# Altium schematic sheet Sheet3.SchDoc: VISB
size 420 x 297 mm; ApprovedBy: PBaizan; CheckedBy: PBaizan; Author: PBaizan; CompanyName: IONOSENS; DrawnBy: PBaizan; Engineer: PBaizan; Organization: IONOSENS; DocumentNumber: 20210001001SCH; Revision: 01; SheetNumber: 03; SheetTotal: 03; SubTitle: VISIR Instrument Supply Board (Connectors); CAGE_CODE: 0001-21; SCH_SCALE: None; DOC_NO_SCH_DWG: 210001001SCH
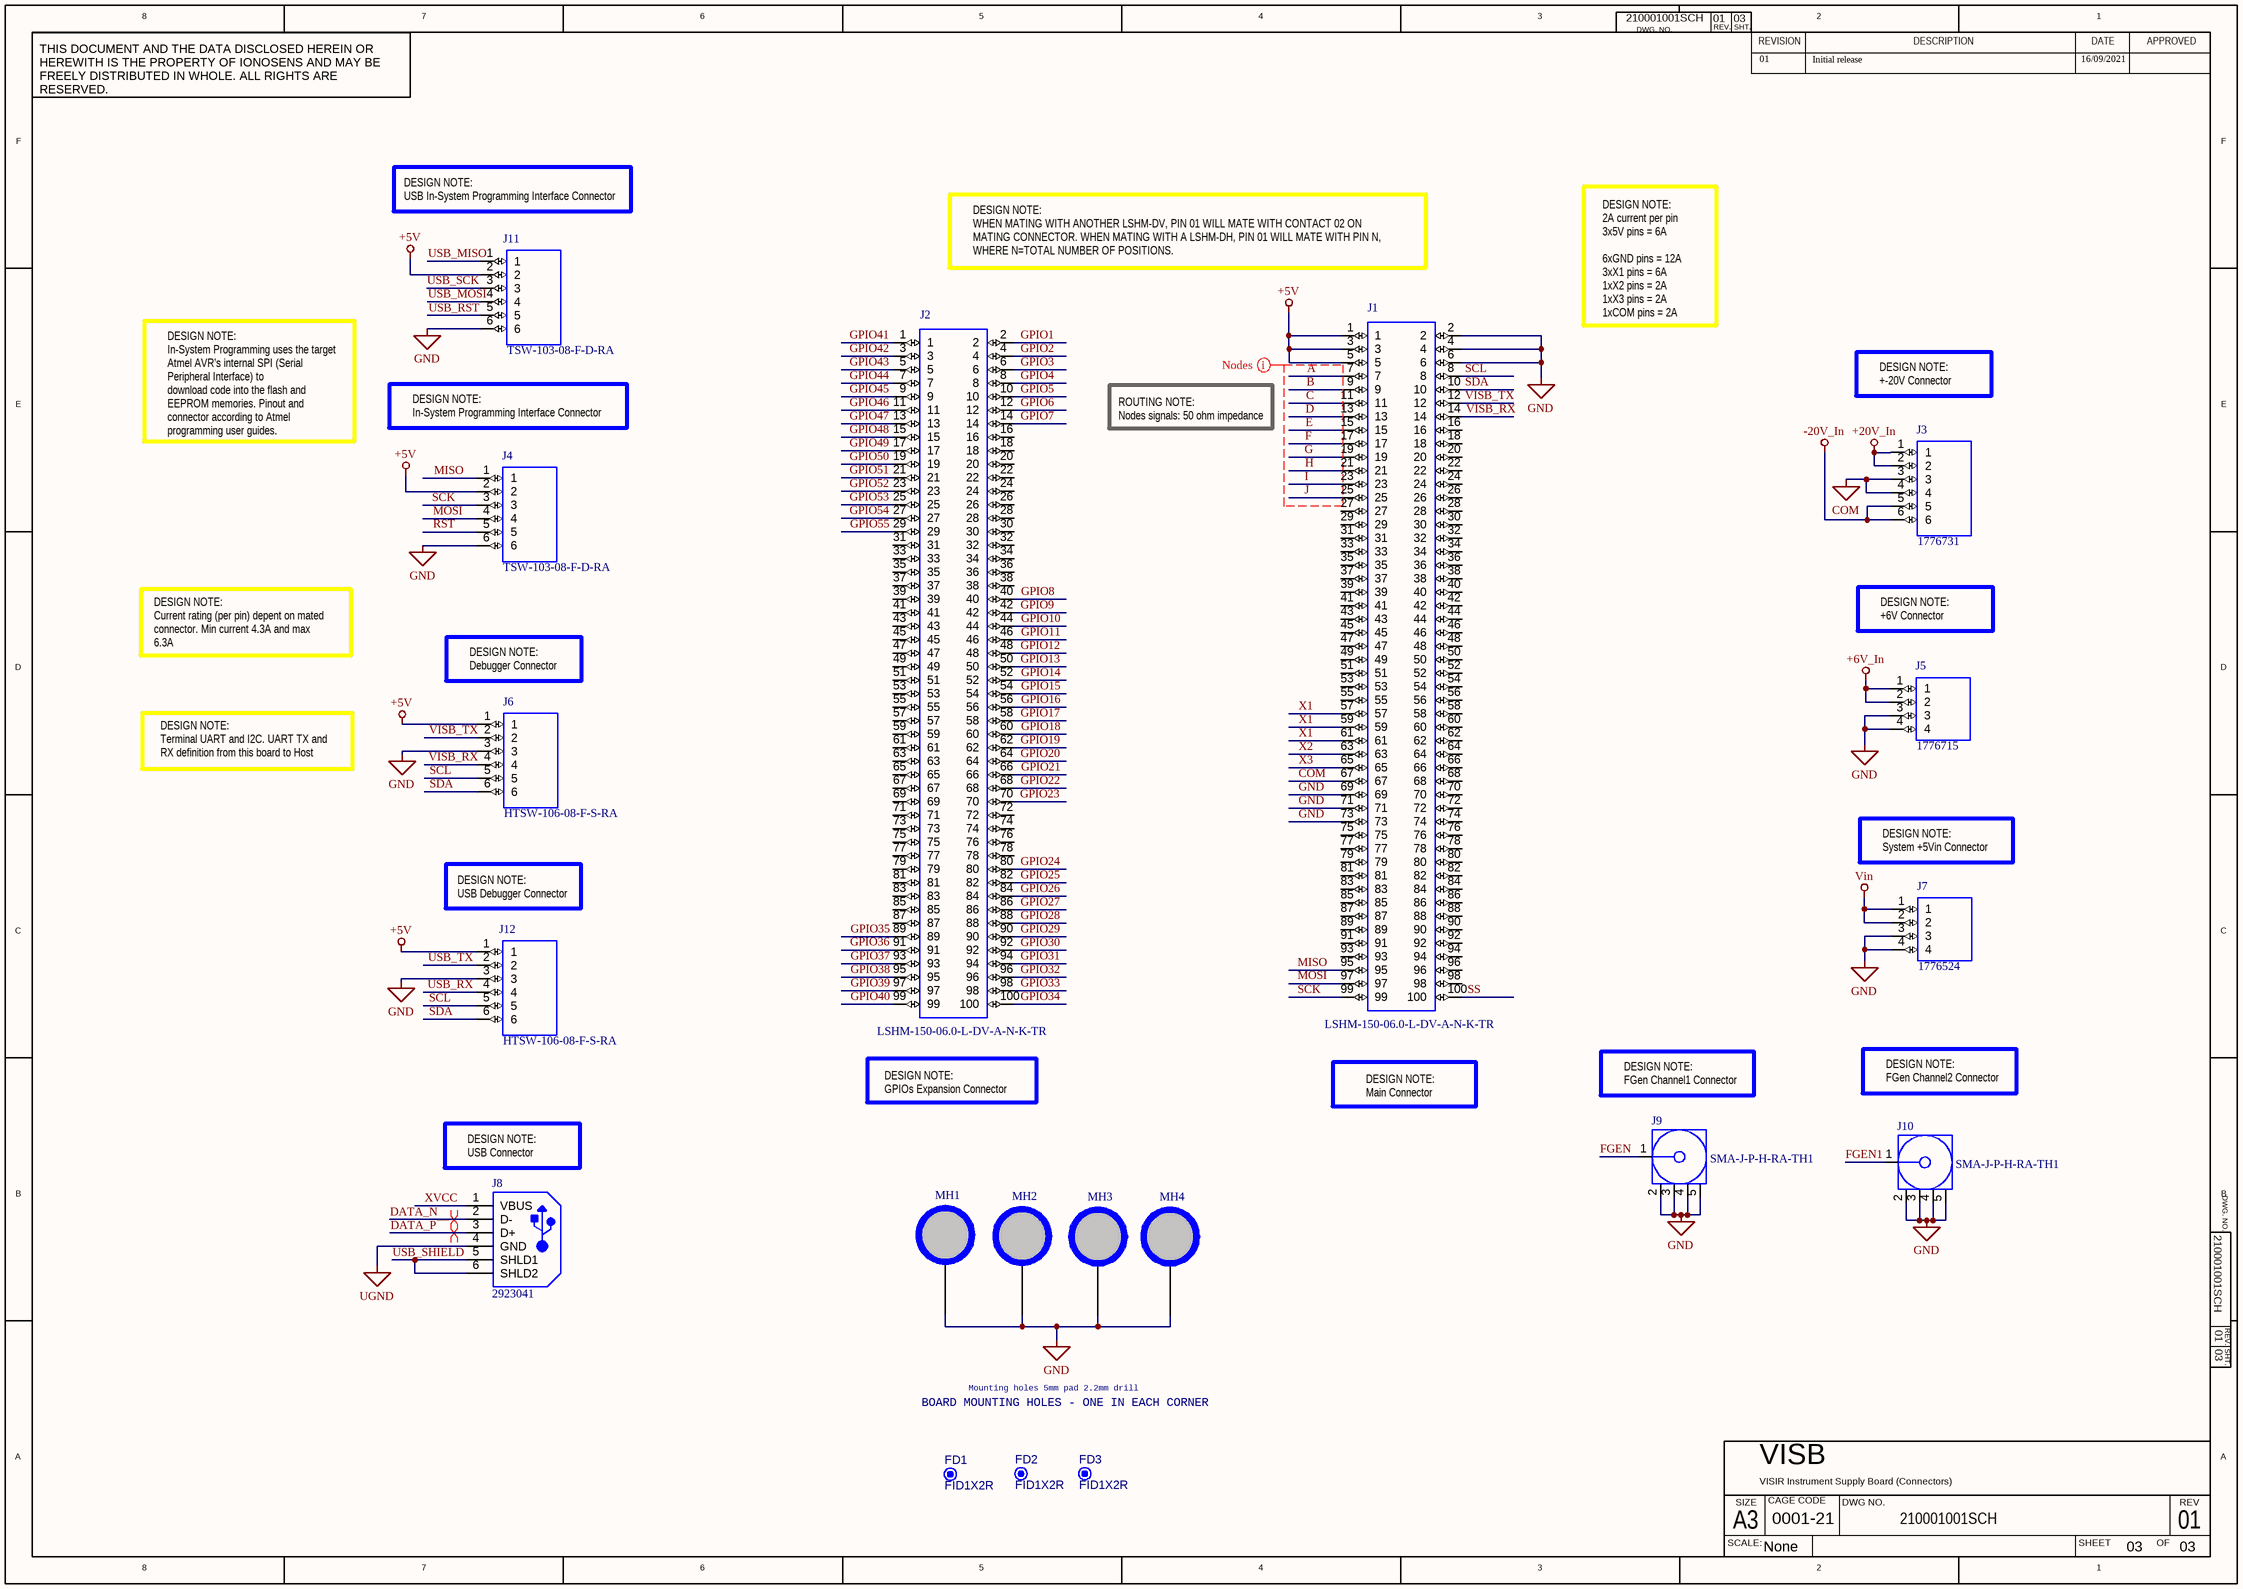
[diagram p0: Sheet3.SchDoc]

## Parts
FD1  FID1X2R  [FID1X2R]  (no BOM)
FD2  FID1X2R  [FID1X2R]  (no BOM)
FD3  FID1X2R  [FID1X2R]  (no BOM)
J1  LSHM-150-06.0-L-DV-A-N-K-TR  [LSHM_150_06_0_L_DV_A_N_K_TR]
J2  LSHM-150-06.0-L-DV-A-N-K-TR  [LSHM_150_06_0_L_DV_A_N_K_TR]
J3  1776731  [1776731]
J4  TSW-103-08-F-D-RA  [TSW-103-08-F-D-RA]
J5  1776715  [1776715]
J6  HTSW-106-08-F-S-RA  [TSW-106-08-F-S-RA]
J7  1776524  [1776537]
J8  2923041  [292304-1]
J9  SMA-J-P-H-RA-TH1  [SMA-J-P-H-RA-TH1]
J10  SMA-J-P-H-RA-TH1  [SMA-J-P-H-RA-TH1]
J11  TSW-103-08-F-D-RA  [TSW-103-08-F-D-RA]
J12  HTSW-106-08-F-S-RA  [TSW-106-08-F-S-RA]
MH1  C500h220  [C500h220z368]  (value not drawn)
MH2  C500h220  [C500h220z368]  (value not drawn)
MH3  C500h220  [C500h220z368]  (value not drawn)
MH4  C500h220  [C500h220z368]  (value not drawn)

## Nets
+5V: J1.1 J1.3 J1.5 J4.2 J6.1 J11.2 J12.1
+6V_In: J5.1 J5.2
+20V_In: J3.1 J3.2
-20V_In: J3.5 J3.6
COM: J1.67 J3.3 J3.4
GND: J1.2 J1.4 J1.6 J1.69 J1.71 J1.73 J4.6 J5.3 J5.4 J6.3 J7.3 J7.4 J9.2 J9.3 J9.4 J9.5 J10.2 J10.3 J10.4 J10.5 J11.6 J12.3 MH1.1 MH2.1 MH3.1 MH4.1
UGND: J8.4(GND)
Vin: J7.1 J7.2
A: J1.7
B: J1.9
C: J1.11
D: J1.13
DATA_N: J8.2(D-)
DATA_P: J8.3(D+)
E: J1.15
F: J1.17
FGEN: J9.1
FGEN1: J10.1
G: J1.19
GPIO1: J2.2
GPIO2: J2.4
GPIO3: J2.6
GPIO4: J2.8
GPIO5: J2.10
GPIO6: J2.12
GPIO7: J2.14
GPIO8: J2.40
GPIO9: J2.42
GPIO10: J2.44
GPIO11: J2.46
GPIO12: J2.48
GPIO13: J2.50
GPIO14: J2.52
GPIO15: J2.54
GPIO16: J2.56
GPIO17: J2.58
GPIO18: J2.60
GPIO19: J2.62
GPIO20: J2.64
GPIO21: J2.66
GPIO22: J2.68
GPIO23: J2.70
GPIO24: J2.80
GPIO25: J2.82
GPIO26: J2.84
GPIO27: J2.86
GPIO28: J2.88
GPIO29: J2.90
GPIO30: J2.92
GPIO31: J2.94
GPIO32: J2.96
GPIO33: J2.98
GPIO34: J2.100
GPIO35: J2.89
GPIO36: J2.91
GPIO37: J2.93
GPIO38: J2.95
GPIO39: J2.97
GPIO40: J2.99
GPIO41: J2.1
GPIO42: J2.3
GPIO43: J2.5
GPIO44: J2.7
GPIO45: J2.9
GPIO46: J2.11
GPIO47: J2.13
GPIO48: J2.15
GPIO49: J2.17
GPIO50: J2.19
GPIO51: J2.21
GPIO52: J2.23
GPIO53: J2.25
GPIO54: J2.27
GPIO55: J2.29
H: J1.21
I: J1.23
J: J1.25
MISO: J1.95 J4.1
MOSI: J1.97 J4.4
RST: J4.5
SCK: J1.99 J4.3
SCL: J1.8 J6.5 J12.5
SDA: J1.10 J6.6 J12.6
SS: J1.100
USB_MISO: J11.1
USB_MOSI: J11.4
USB_RST: J11.5
USB_RX: J12.4
USB_SCK: J11.3
USB_SHIELD: J8.5(SHLD1) J8.6(SHLD2)
USB_TX: J12.2
VISB_RX: J1.14 J6.4
VISB_TX: J1.12 J6.2
X1: J1.57 J1.59 J1.61
X2: J1.63
X3: J1.65
XVCC: J8.1(VBUS)

Not connected (* = marked no-connect by the designer): J1 16 18 20 22 24 26 27 28 29 30 31 32 33 34 35 36 37 38 39 40 41 42 43 44 45 46 47 48 49 50 51 52 53 54 55 56 58 60 62 64 66 68 70 72 74 75 76 77 78 79 80 81 82 83 84 85 86 87 88 89 90 91 92 93 94 96 98; J2 16 18 20 22 24 26 28 30 31 32 33 34 35 36 37 38 39 41 43 45 47 49 51 53 55 57 59 61 63 65 67 69 71 72 73 74 75 76 77 78 79 81 83 85 87

## Layout directives
net class Nodes: A, B, C, D, E, F, G, H, I, J
differential pair: DATA_N, DATA_P

## Notes on the sheet
- 01
- Initial release
- 16/09/2021
- DESIGN NOTE:
  USB In-System Programming Interface Connector
- DESIGN NOTE:
  WHEN MATING WITH ANOTHER LSHM-DV, PIN 01 WILL MATE WITH CONTACT 02 ON
  MATING CONNECTOR. WHEN MATING WITH A LSHM-DH, PIN 01 WILL MATE WITH PIN N,
  WHERE N=TOTAL NUMBER OF POSITIONS.
- DESIGN NOTE:
  2A current per pin
  3x5V pins = 6A
  6xGND pins = 12A
  3xX1 pins = 6A
  1xX2 pins = 2A
  1xX3 pins = 2A
  1xCOM pins = 2A
- DESIGN NOTE:
  +-20V Connector
- DESIGN NOTE:
  In-System Programming uses the target Atmel AVR’s internal SPI (Serial Peripheral Interface) to
  download code into the flash and EEPROM memories. Pinout and connector according to Atmel programming user guides.
- DESIGN NOTE:
  In-System Programming Interface Connector
- ROUTING NOTE:
  Nodes signals: 50 ohm impedance
- DESIGN NOTE:
  Current rating (per pin) depent on mated connector. Min current 4.3A and max 6.3A
- DESIGN NOTE:
  +6V Connector
- (near J6) DESIGN NOTE:
  Debugger Connector
- DESIGN NOTE:
  Terminal UART and I2C. UART TX and RX definition from this board to Host
- (near J7) DESIGN NOTE:
  System +5Vin Connector
- (near J12) DESIGN NOTE:
  USB Debugger Connector
- DESIGN NOTE:
  GPIOs Expansion Connector
- DESIGN NOTE:
  Main Connector
- DESIGN NOTE:
  FGen Channel1 Connector
- DESIGN NOTE:
  FGen Channel2 Connector
- (near J8) DESIGN NOTE:
  USB Connector
- BOARD MOUNTING HOLES - ONE IN EACH CORNER
- Mounting holes 5mm pad 2.2mm drill
- 8
- 7
- 6
- 5
- 4
- 3
- DWG. NO.
- REV.
- SHT.
- REVISION
- 2
- DESCRIPTION
- DATE
- 1
- APPROVED
- THIS DOCUMENT AND THE DATA DISCLOSED HEREIN OR HEREWITH IS THE PROPERTY OF IONOSENS AND MAY BE FREELY DISTRIBUTED IN WHOLE. ALL RIGHTS ARE RESERVED.
- F
- E
- D
- C
- B
- A
- SCALE:
- A3
- SIZE
- CAGE CODE
- DWG NO.
- SHEET
- OF
- REV

## Library data of the parts
FD1-FD3 = CMP-00028-00005-2: Fiducial - Round 1x2mm; Pins: 0
J1 J2 = J01-001-01-00001-2: Conn Socket and Terminal Strip HDR/SKT 100 POS 0.5mm Solder ST SMD T/R; Manufacturer: Samtec; Gender: HERMAPHRODITIC; Pitch: 500 µm; Contact Plating: Gold; Case/Package: SMD; Max Operating Temperature: 125°C; Number of Rows: 2; RoHS Compliant: Yes; Housing Color: Black; Mounting Technology: SMD; Pins: 100; Termination: Solder; Orientation: Straight; Depth: 4.98 mm; Length: 29.7 mm; Contact Material: Bronze; Housing Material: Polymer; Min Operating Temperature: -55°C; Manufacturer P/N: LSHM-150-06.0-L-DV-A-N-K-TR
J3 = J01-001-01-00006-1: Pluggable Terminal Blocks 6 Pos 5mm pitch Thro ugh Hole Header; Manufacturer: Phoenix Contact; Gender: Male; Number of Rows: 1; RoHS Compliant: Yes; Contact Material: -; Mounting Technology: TH; Case/Package: TH; Pitch: 5 mm; Termination: Tin; Contact Plating: Tin; Housing Color: Green; Pins: 6; Max Operating Temperature: 125°C; Length: 40; Housing Material: Polybutylene; Manufacturer P/N: 1776731; Min Operating Temperature: -55°C; Depth: 12; Orientation: Right Angle
J4 J11 = J01-001-01-00003-2: 6 Vias Pin Header 2.54mm, Right Angle; Manufacturer: Samtec; Gender: Male; Orientation: Straight; Mounting Technology: Through Hole; Contact Material: Bronze; Housing Material: Polyester; Pitch: 2.54mm; Housing Color: Black; Termination: Solder; Min Operating Temperature: -55°C; Pins: 6; Depth: 4.87 mm; RoHS Compliant: Yes; Manufacturer P/N: TSW-103-08-F-D-RA; Length: 7.62 mm; Contact Plating: Gold; Number of Rows: 2; Max Operating Temperature: 125°C; Case/Package: Through Hole
J5 = J01-001-01-00007-2: Pluggable Terminal Blocks 4 Pos 5mm pitch Thro ugh Hole Header; Manufacturer: Phoenix Contact; Gender: Male; Pitch: 5; Housing Color: Green; Orientation: Right Angle; Housing Material: Polybutylene; Number of Rows: 1; Max Operating Temperature: 125°C; Contact Material: -; Case/Package: TH; Depth: 12; Contact Plating: Tin; RoHS Compliant: Yes; Pins: 4; Termination: Solder; Mounting Technology: TH; Manufacturer P/N: 1776715; Length: 30; Min Operating Temperature: -55°C
J6 J12 = J01-001-01-00005-2: 6 Vias Pin Header 2.54mm, Right Angle, 1 Row; Manufacturer: Samtec; Gender: Male; Mounting Technology: Through Hole; RoHS Compliant: Yes; Contact Plating: Gold; Max Operating Temperature: 125°C; Pins: 6; Housing Material: Polyester; Case/Package: Through Hole; Pitch: 2.54mm; Contact Material: Bronze; Length: 7.62 mm; Termination: Solder; Number of Rows: 2; Manufacturer P/N: HTSW-106-08-F-S-RA; Depth: 4.87 mm; Orientation: Straight; Min Operating Temperature: -55°C; Housing Color: Black
J7 = J01-001-01-00008-1: Pluggable Terminal Blocks 4 Pos 5.08mm pitch T hrough Hole Header; Manufacturer: Phoenix Contact; Gender: Male; Manufacturer P/N: 1776524; Min Operating Temperature: -55°C; Contact Material: -; Pitch: 5.08mm; RoHS Compliant: Yes; Orientation: Right Angle; Max Operating Temperature: 155°C; Case/Package: TH; Termination: Solder; Housing Material: Polybutylene; Depth: 12; Number of Rows: 1; Housing Color: Green; Length: 30.48mm; Pins: 4; Mounting Technology: TH; Contact Plating: Tin
J8 = J01-001-01-00004-1: Conn USB 2.0 Type B RCP 4 POS 2.5mm Solder RA Thru-Hole 4 Terminal 1 Port Box/Tray; Manufacturer: TE Conectivity; Gender: Receptacle; Min Operating Temperature: 55°C; Housing Color: Black; Orientation: Right Angle; Max Operating Temperature: 125°C; Pins: 4; Pitch: -; RoHS Compliant: Yes; Case/Package: TH; Termination: -; Length: 15.71 mm; Contact Plating: Gold; Depth: -; Manufacturer P/N: 292304-1; Housing Material: Thermoplastic; Contact Material: Copper; Number of Rows: 2; Mounting Technology: TH
J9 J10 = J01-001-01-00009-2: Conn SMA RCP 0Hz to 18GHz 50Ohm Solder RA Thru-Hole Gold; Manufacturer: Samtec; Pitch: 0; Gender: Female; Contact Material: Copper, Gold; RoHS Compliant: Yes; Termination: solder; Min Operating Temperature: -65°C; Number of Rows: 1; Manufacturer P/N: SMA-J-P-H-RA-TH1; Housing Material: Copper, Gold; Mounting Technology: TH; Case/Package: TH; Orientation: Right angle; Length: 15.1mm; Depth: 7mm; Housing Color: Gold; Max Operating Temperature: 125°C; Pins: 5; Contact Plating: Gold
MH1-MH4 = CMP-00028-00007-2: hole 5mm pad drill 2.2; Manufacturer: Ionosens; Manufacturer P/N: H5D22; Mounting Technology: Pad; RoHS Compliant: yes; Case/Package: Pad; Min Operating Temperature: 125°C; Pins: 1; Max Operating Temperature: -40°C